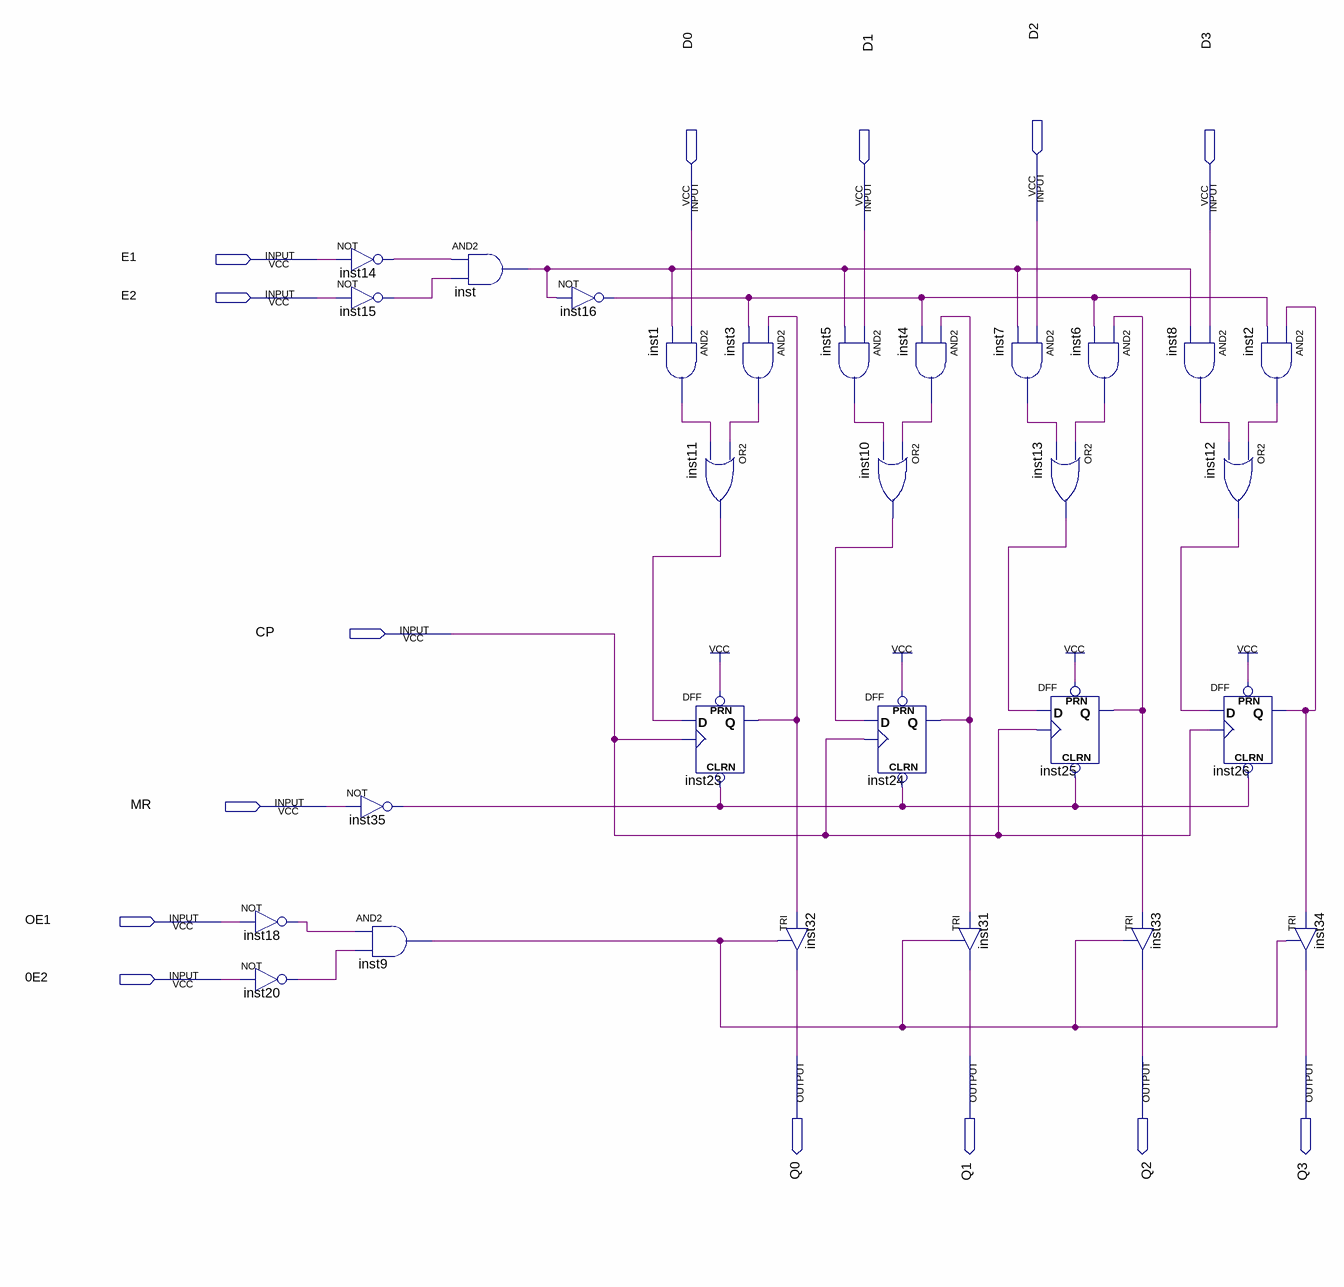
[diagram p0: schematic sheet]
// Quartus schematic 74173.bdf as structural Verilog: 28 symbols, 14 pins
module \74173  (
  input  D2,
  input  D0,
  input  D1,
  input  D3,
  input  E1,
  input  E2,
  input  CP,
  input  MR,
  input  OE1,
  input  \0E2 ,
  output Q0,
  output Q1,
  output Q2,
  output Q3
);

  wire inst1_out, inst2_out, inst3_out, inst4_out, inst5_out, inst6_out, inst7_out, inst8_out, inst9_out,
       inst10_out, inst11_out, inst12_out, inst13_out, inst14_out, inst15_out, inst16_out, inst18_out,
       inst20_out, inst23_q, inst24_q, inst25_q, inst26_q, inst35_out, inst_out;

  not inst18 (inst18_out, OE1);
  not inst20 (inst20_out, \0E2 );
  not inst14 (inst14_out, E1);
  not inst15 (inst15_out, E2);
  not inst35 (inst35_out, MR);
  and inst9 (inst9_out, inst18_out, inst20_out);
  and inst (inst_out, inst14_out, inst15_out);
  not inst16 (inst16_out, inst_out);
  and inst1 (inst1_out, D0, inst_out);
  or inst11 (inst11_out, inst3_out, inst1_out);
  DFF inst23 (.CLRN(inst35_out), .CLK(CP), .D(inst11_out), .PRN(1'b1), .Q(inst23_q));
  and inst3 (inst3_out, inst23_q, inst16_out);
  and inst5 (inst5_out, D1, inst_out);
  TRI inst32 (.IN(inst23_q), .OE(inst9_out), .OUT(Q0));
  and inst4 (inst4_out, inst24_q, inst16_out);
  or inst10 (inst10_out, inst4_out, inst5_out);
  DFF inst24 (.CLRN(inst35_out), .CLK(CP), .D(inst10_out), .PRN(1'b1), .Q(inst24_q));
  and inst7 (inst7_out, D2, inst_out);
  TRI inst31 (.IN(inst24_q), .OE(inst9_out), .OUT(Q1));
  and inst6 (inst6_out, inst25_q, inst16_out);
  or inst13 (inst13_out, inst6_out, inst7_out);
  DFF inst25 (.CLRN(inst35_out), .CLK(CP), .D(inst13_out), .PRN(1'b1), .Q(inst25_q));
  TRI inst33 (.IN(inst25_q), .OE(inst9_out), .OUT(Q2));
  and inst8 (inst8_out, D3, inst_out);
  or inst12 (inst12_out, inst2_out, inst8_out);
  DFF inst26 (.CLRN(inst35_out), .CLK(CP), .D(inst12_out), .PRN(1'b1), .Q(inst26_q));
  and inst2 (inst2_out, inst26_q, inst16_out);
  TRI inst34 (.IN(inst26_q), .OE(inst9_out), .OUT(Q3));
endmodule
